# Altium schematic sheet Mechanical.SchDoc
size A3
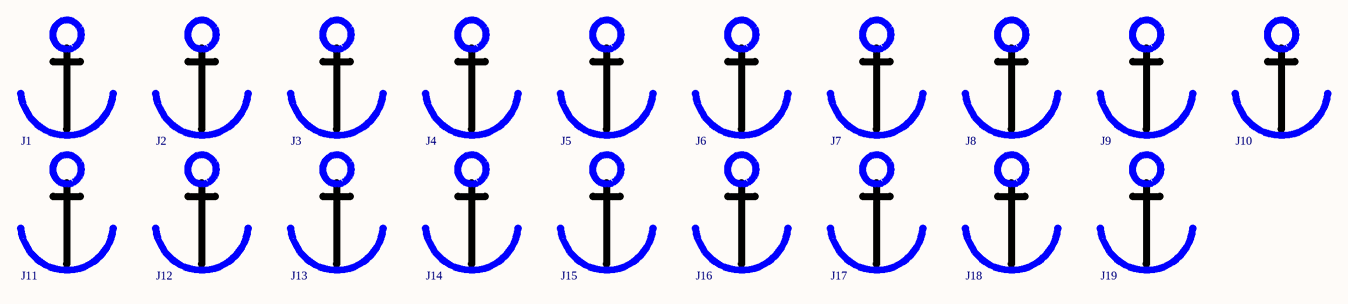
[diagram p0: Mechanical.SchDoc]

## Parts
J1  Hook_Point  [Hook_Point]  (value not drawn)
J2  Hook_Point  [Hook_Point]  (value not drawn)
J3  Hook_Point  [Hook_Point]  (value not drawn)
J4  Hook_Point  [Hook_Point]  (value not drawn)
J5  Hook_Point  [Hook_Point]  (value not drawn)
J6  Hook_Point  [Hook_Point]  (value not drawn)
J7  Hook_Point  [Hook_Point]  (value not drawn)
J8  Hook_Point  [Hook_Point]  (value not drawn)
J9  Hook_Point  [Hook_Point]  (value not drawn)
J10  Hook_Point  [Hook_Point]  (value not drawn)
J11  Hook_Point  [Hook_Point]  (value not drawn)
J12  Hook_Point  [Hook_Point]  (value not drawn)
J13  Hook_Point  [Hook_Point]  (value not drawn)
J14  Hook_Point  [Hook_Point]  (value not drawn)
J15  Hook_Point  [Hook_Point]  (value not drawn)
J16  Hook_Point  [Hook_Point]  (value not drawn)
J17  Hook_Point  [Hook_Point]  (value not drawn)
J18  Hook_Point  [Hook_Point]  (value not drawn)
J19  Hook_Point  [Hook_Point]  (value not drawn)